# Altium schematic sheet LED_POV.SchDoc
size A4
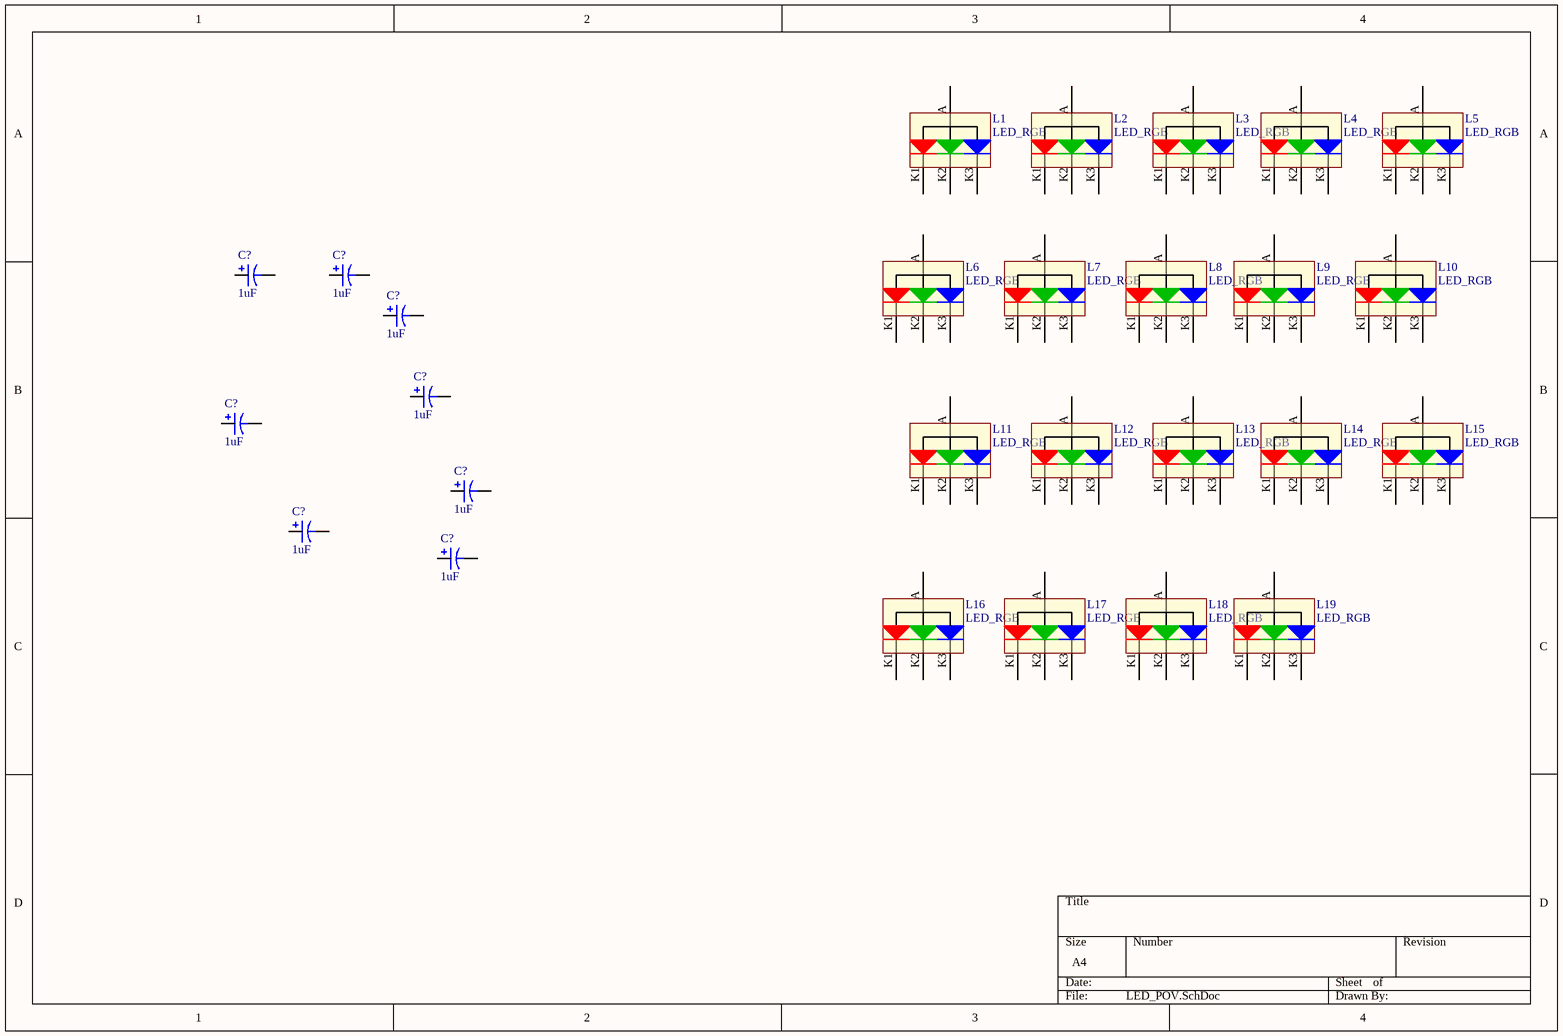
[diagram p0: LED_POV.SchDoc]

## Parts
(Parts that share a designator on the sheet are numbered #1, #2 ... from top to bottom, then left to right.)
C?#1  1uF  [cap_5x11]
C?#2  1uF  [cap_5x11]
C?#3  1uF  [cap_5x11]
C?#4  1uF  [cap_5x11]
C?#5  1uF  [cap_5x11]
C?#6  1uF  [cap_5x11]
C?#7  1uF  [cap_5x11]
C?#8  1uF  [cap_5x11]
L1  LED_RGB  [LED_0605_RGB]
L2  LED_RGB  [LED_0605_RGB]
L3  LED_RGB  [LED_0605_RGB]
L4  LED_RGB  [LED_0605_RGB]
L5  LED_RGB  [LED_0605_RGB]
L6  LED_RGB  [LED_0605_RGB]
L7  LED_RGB  [LED_0605_RGB]
L8  LED_RGB  [LED_0605_RGB]
L9  LED_RGB  [LED_0605_RGB]
L10  LED_RGB  [LED_0605_RGB]
L11  LED_RGB  [LED_0605_RGB]
L12  LED_RGB  [LED_0605_RGB]
L13  LED_RGB  [LED_0605_RGB]
L14  LED_RGB  [LED_0605_RGB]
L15  LED_RGB  [LED_0605_RGB]
L16  LED_RGB  [LED_0605_RGB]
L17  LED_RGB  [LED_0605_RGB]
L18  LED_RGB  [LED_0605_RGB]
L19  LED_RGB  [LED_0605_RGB]

## Nets

Not connected (* = marked no-connect by the designer): C?#1 N P; C?#2 N P; C?#3 N P; C?#4 N P; C?#5 N P; C?#6 N P; C?#7 N P; C?#8 N P; L1 A(A+) K1(R) K2(G) K3(B); L2 A(A+) K1(R) K2(G) K3(B); L3 A(A+) K1(R) K2(G) K3(B); L4 A(A+) K1(R) K2(G) K3(B); L5 A(A+) K1(R) K2(G) K3(B); L6 A(A+) K1(R) K2(G) K3(B); L7 A(A+) K1(R) K2(G) K3(B); L8 A(A+) K1(R) K2(G) K3(B); L9 A(A+) K1(R) K2(G) K3(B); L10 A(A+) K1(R) K2(G) K3(B); L11 A(A+) K1(R) K2(G) K3(B); L12 A(A+) K1(R) K2(G) K3(B); L13 A(A+) K1(R) K2(G) K3(B); L14 A(A+) K1(R) K2(G) K3(B); L15 A(A+) K1(R) K2(G) K3(B); L16 A(A+) K1(R) K2(G) K3(B); L17 A(A+) K1(R) K2(G) K3(B); L18 A(A+) K1(R) K2(G) K3(B); L19 A(A+) K1(R) K2(G) K3(B)

## Library data of the parts
C?#1-C?#8 = CAP_ELECT: Polarized Capacitor; Value: 1uF
L1-L19 = LED_RGB: LED_RGB_COMMON_ANODE